# Altium schematic sheet Sheet_1_2022-02-26.schdoc
size 311 x 219 mm
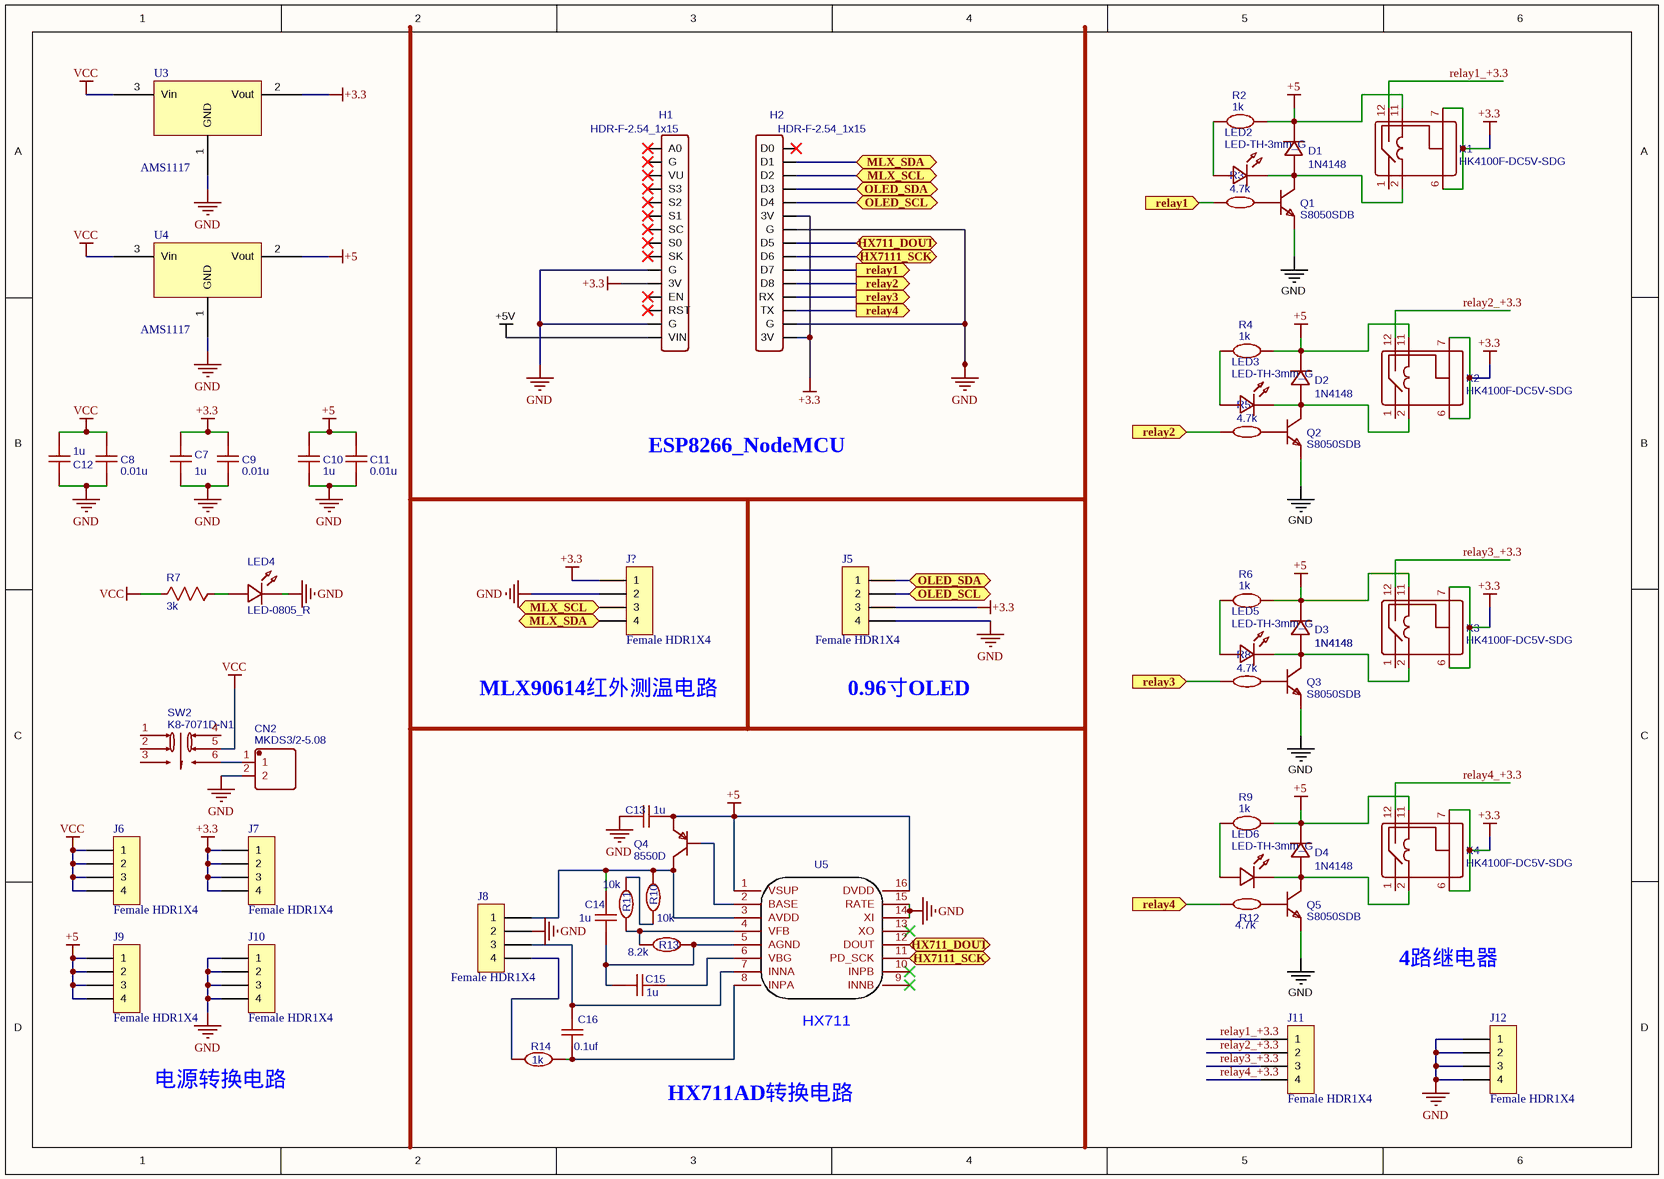
[diagram p0: Sheet_1_2022-02-26.schdoc]

## Parts
C7  1u  [C0805]
C8  0.01u  [C0805]
C9  0.01u  [C0805]
C10  1u  [C0805]
C11  0.01u  [C0805]
C12  1u  [C0805]
C13  1u  [C0603]
C14  1u  [C0603]
C15  1u  [C0603]
C16  0.1uf  [C0603]
CN2  MKDS3/2-5.08  [CONN-TH_MKDS3/2-5.08]
D1  1N4148  [DO35-7]
D2  1N4148  [DO35-7]
D3  1N4148  [DO35-7]
D4  1N4148  [DO35-7]
H1  HDR-F-2.54_1x15  [HDR-F-2.54_1X15]
H2  HDR-F-2.54_1x15  [HDR-F-2.54_1X15]
J5  Female HDR1X4  [Fe-HDR1X4/2.54-S]
J6  Female HDR1X4  [Fe-HDR1X4/2.54-S]
J7  Female HDR1X4  [Fe-HDR1X4/2.54-S]
J8  Female HDR1X4  [Fe-HDR1X4/2.54-S]
J9  Female HDR1X4  [Fe-HDR1X4/2.54-S]
J10  Female HDR1X4  [Fe-HDR1X4/2.54-S]
J11  Female HDR1X4  [Fe-HDR1X4/2.54-S]
J12  Female HDR1X4  [Fe-HDR1X4/2.54-S]
J?  Female HDR1X4  [Fe-HDR1X4/2.54-S]
K1  HK4100F-DC5V-SDG  [RELAY-TH_HK4100F-DC5V-SDG]
K2  HK4100F-DC5V-SDG  [RELAY-TH_HK4100F-DC5V-SDG]
K3  HK4100F-DC5V-SDG  [RELAY-TH_HK4100F-DC5V-SDG]
K4  HK4100F-DC5V-SDG  [RELAY-TH_HK4100F-DC5V-SDG]
LED2  LED-TH-3mm_G  [LED-TH_BD3.0_GREEN]
LED3  LED-TH-3mm_G  [LED-TH_BD3.0_GREEN]
LED4  LED-0805_R  [LED0805_RED]
LED5  LED-TH-3mm_G  [LED-TH_BD3.0_GREEN]
LED6  LED-TH-3mm_G  [LED-TH_BD3.0_GREEN]
Q1  S8050SDB  [T0-92]
Q2  S8050SDB  [T0-92]
Q3  S8050SDB  [T0-92]
Q4  8550D  [SOT-23-3_L2.9-W1.6-P1.90-LS2.8-BR-CW]
Q5  S8050SDB  [T0-92]
R2  1k  [R_AXIAL-0.3]
R3  4.7k  [R_AXIAL-0.3]
R4  1k  [R_AXIAL-0.3]
R5  4.7k  [R_AXIAL-0.3]
R6  1k  [R_AXIAL-0.3]
R7  3k  [R0805]
R8  4.7k  [R_AXIAL-0.3]
R9  1k  [R_AXIAL-0.3]
R10  10k  [R0805]
R11  10k  [R0805]
R12  4.7k  [R_AXIAL-0.3]
R13  8.2k  [R0603]
R14  1k  [R0805]
SW2  K8-7071D-N1  [KEY-TH_6P-L7.0-W7.0-P2.00]
U3  AMS1117  [SOT223]
U4  AMS1117  [SOT223]
U5  HX711  [SOP-16_L10.0-W3.9-P1.27-LS6.0-BL]  (value not drawn)

## Ports
HX711_DOUT (bidir), HX7111_SCK (bidir), MLX_SCL (bidir), MLX_SDA (bidir), OLED_SCL (bidir), OLED_SDA (bidir), relay1 (in), relay1 (out), relay2 (in), relay2 (out), relay3 (in), relay3 (out), relay4 (in), relay4 (out)

## Nets
+3.3: C7.2 C9.2 H1.11(3V) H2.6(3V) H2.15(3V) J5.3 J7.1 J7.2 J7.3 J7.4 J?.1 K1.6 K1.7 K2.6 K2.7 K3.6 K3.7 K4.6 K4.7 U3.2(Vout)
+5: C10.2 C11.2 C13.2 D1.C D2.C D3.C D4.C J9.1 J9.2 J9.3 J9.4 K1.11 K2.11 K3.11 K4.11 Q4.1(E) R2.2 R4.2 R6.2 R9.2 U4.2(Vout) U5.1(VSUP) U5.16(DVDD)
+5V: H1.15(VIN)
GND: C7.1 C8.1 C9.1 C10.1 C11.1 C12.1 C13.1 CN2.2 H1.10(G) H1.14(G) H2.7(G) H2.14(G) J5.4 J8.2 J10.1 J10.2 J10.3 J10.4 J12.1 J12.2 J12.3 J12.4 J?.2 LED4.2 Q1.1(E) Q2.1(E) Q3.1(E) Q5.1(E) U3.1(GND) U4.1(GND) U5.14(XI) U5.15(RATE)
VCC: C8.2 C12.2 J6.1 J6.2 J6.3 J6.4 R7.2 SW2.5 U3.3(Vin) U4.3(Vin)
HX711_DOUT: H2.8(D5) U5.12(DOUT) ; port HX711_DOUT
HX7111_SCK: H2.9(D6) U5.11(PD_SCK) ; port HX7111_SCK
MLX_SCL: H2.3(D2) J?.3 ; port MLX_SCL
MLX_SDA: H2.2(D1) J?.4 ; port MLX_SDA
OLED_SCL: H2.5(D4) J5.2 ; port OLED_SCL
OLED_SDA: H2.4(D3) J5.1 ; port OLED_SDA
relay1: H2.10(D7) R3.2 ; port relay1
relay1_+3.3: J11.1 K1.12
relay2: H2.11(D8) R5.2 ; port relay2
relay2_+3.3: J11.2 K2.12
relay3: H2.12(RX) R8.2 ; port relay3
relay3_+3.3: J11.3 K3.12
relay4: H2.13(TX) R12.2 ; port relay4
relay4_+3.3: J11.4 K4.12
NetC14_1: C14.1 C15.1 R13.2 U5.5(AGND)
NetC14_2: C14.2 J8.1 Q4.3(C) R10.2 U5.3(AVDD)
NetC15_2: C15.2 U5.6(VBG)
NetC16_1: C16.1 R14.2 U5.8(INPA)
NetC16_2: C16.2 J8.3 U5.7(INNA)
NetCN2_1: CN2.1 SW2.6
NetD1_A: D1.A K1.2 LED2.2 Q1.3(C)
NetD2_A: D2.A K2.2 LED3.2 Q2.3(C)
NetD3_A: D3.A K3.2 LED5.2 Q3.3(C)
NetD4_A: D4.A K4.2 LED6.2 Q5.3(C)
NetJ8_4: J8.4 R14.1
NetLED2_1: LED2.1 R2.1
NetLED3_1: LED3.1 R4.1
NetLED4_1: LED4.1 R7.1
NetLED5_1: LED5.1 R6.1
NetLED6_1: LED6.1 R9.1
NetQ1_2: Q1.2(B) R3.1
NetQ2_2: Q2.2(B) R5.1
NetQ3_2: Q3.2(B) R8.1
NetQ4_2: Q4.2(B) U5.2(BASE)
NetQ5_2: Q5.2(B) R12.1
NetR10_1: R10.1 R11.2
NetR11_1: R11.1 R13.1 U5.4(VFB)

Not connected (* = marked no-connect by the designer): H1 1(A0)* 2(G)* 3(VU)* 4(S3)* 5(S2)* 6(S1)* 7(SC)* 8(S0)* 9(SK)* 12(EN)* 13(RST)*; H2 1(D0)*; K1 1; K2 1; K3 1; K4 1; SW2 1 2 3 4; U5 9(INNB)* 10(INPB)* 13(XO)*

## Notes on the sheet
- ESP8266_NodeMCU
- 1N4148
- MLX90614红外测温电路
- 0.96寸OLED
- 4路继电器
- 电源转换电路
- HX711AD转换电路

## Library data of the parts
C7 C10 C12-C15 = 1u: nameAlias: Value(F); Contributor: LCEDA_Lib; spicePre: C
  C7 C10 C12: spiceSymbolName: C_0805_US
  C13-C15: spiceSymbolName: C_RAD-0.1_US
C8 C9 C11 = 0.01u: nameAlias: Value(F); Contributor: LCEDA_Lib; spicePre: C; spiceSymbolName: C_0805_US
C16 = 0.1uf: nameAlias: Value(F); Contributor: LCEDA_Lib; spicePre: C; spiceSymbolName: C_RAD-0.1_US
CN2 = MKDS3/2-5.08: BOM_Manufacturer: Phoenix Contact; BOM_Supplier: LCSC; BOM_Manufacturer Part: MKDS3/2-5.08; BOM_Supplier Part: C89120; spicePre: C; spiceSymbolName: MKDS3/2-5.08
D1-D4 = 1N4148: nameAlias: Model; BOM_Manufacturer Part: ?; spicePre: D; spiceSymbolName: Diode
H1 H2 = HDR-F-2.54_1x15: Contributor: LCEDA_Lib; BOM_Supplier Part: C124408; BOM_Supplier: LCSC; spicePre: H; spiceSymbolName: HDR-F-2.54_1x15
K1-K4 = HK4100F-DC5V-SDG: BOM_Manufacturer: Ningbo Keke New Era Appliance; Contributor: LCSC; BOM_Supplier: LCSC; BOM_Supplier Part: C185866; BOM_Manufacturer Part: HK4100F-DC5V-SDG; spicePre: K; spiceSymbolName: HK4100F-DC5V-SDG
LED2 LED3 LED5 LED6 = LED-TH-3mm_G: BOM_Manufacturer: EVERLIGHT(台湾亿光); BOM_Manufacturer Part: 204-10SYGD/S530-E3; Contributor: LCEDA_Lib; BOM_Supplier Part: C85161; spicePre: L; spiceSymbolName: LED-TH-3mm_G
LED4 = LED-0805_R: BOM_Manufacturer: EVERLIGHT(台湾亿光); BOM_Manufacturer Part: 17-21SURC/S530-A3/TR8; Contributor: LCEDA_Lib; BOM_Supplier Part: C72037; spicePre: L; spiceSymbolName: LED-0805_R
Q1-Q3 Q5 = S8050SDB: BOM_Manufacturer: FeiHong; Contributor: LCSC; BOM_Supplier: LCSC; BOM_Supplier Part: C438624; BOM_Manufacturer Part: S8050SDB; spicePre: Q; spiceSymbolName: S8050SDB
Q4 = 8550D: BOM_Manufacturer: SEMTECH; Contributor: LCSC; BOM_Supplier: LCSC; BOM_Manufacturer Part: 8550D; BOM_Supplier Part: C118549; spicePre: Q; spiceSymbolName: 8550D
R2 R4 R6 R9 R14 = 1k: nameAlias: Value(Ω); Contributor: LCEDA_Lib; spicePre: R; spiceSymbolName: R_AXIAL-0.3_EU
R3 R5 R8 R12 = 4.7k: nameAlias: Value(Ω); BOM_Manufacturer Part: ?; spicePre: R; spiceSymbolName: Resistor
R7 = 3k: nameAlias: Value(Ω); Contributor: LCEDA_Lib; spicePre: R; spiceSymbolName: R_0805_US
R10 R11 = 10k: nameAlias: Value(Ω); Contributor: LCEDA_Lib; spicePre: R; spiceSymbolName: R_0805_EU
R13 = 8.2k: nameAlias: Value(Ω); Contributor: LCEDA_Lib; spicePre: R; spiceSymbolName: R_AXIAL-0.3_EU
SW2 = K8-7071D-N1: BOM_Manufacturer: HRO; Contributor: LCSC; BOM_Supplier: LCSC; BOM_Manufacturer Part: K8-7071D-N1; BOM_Supplier Part: C136692; spicePre: S; spiceSymbolName: K8-7071D-N1
U3 U4 = AMS1117: 三端稳压芯片
U5 = HX711: BOM_Manufacturer: AVIA; SMT Type: Extend; BOM_Supplier: LCSC; BOM_Manufacturer Part: HX711; image: //image.lceda.cn/szlcsc/C43656.jpg; BOM_Supplier Part: C43656; BOM_LCSC Assembly: Yes; spicePre: U; spiceSymbolName: HX711